# EasyEDA Pro project ACS Core.eprj, board Card Slot Reader
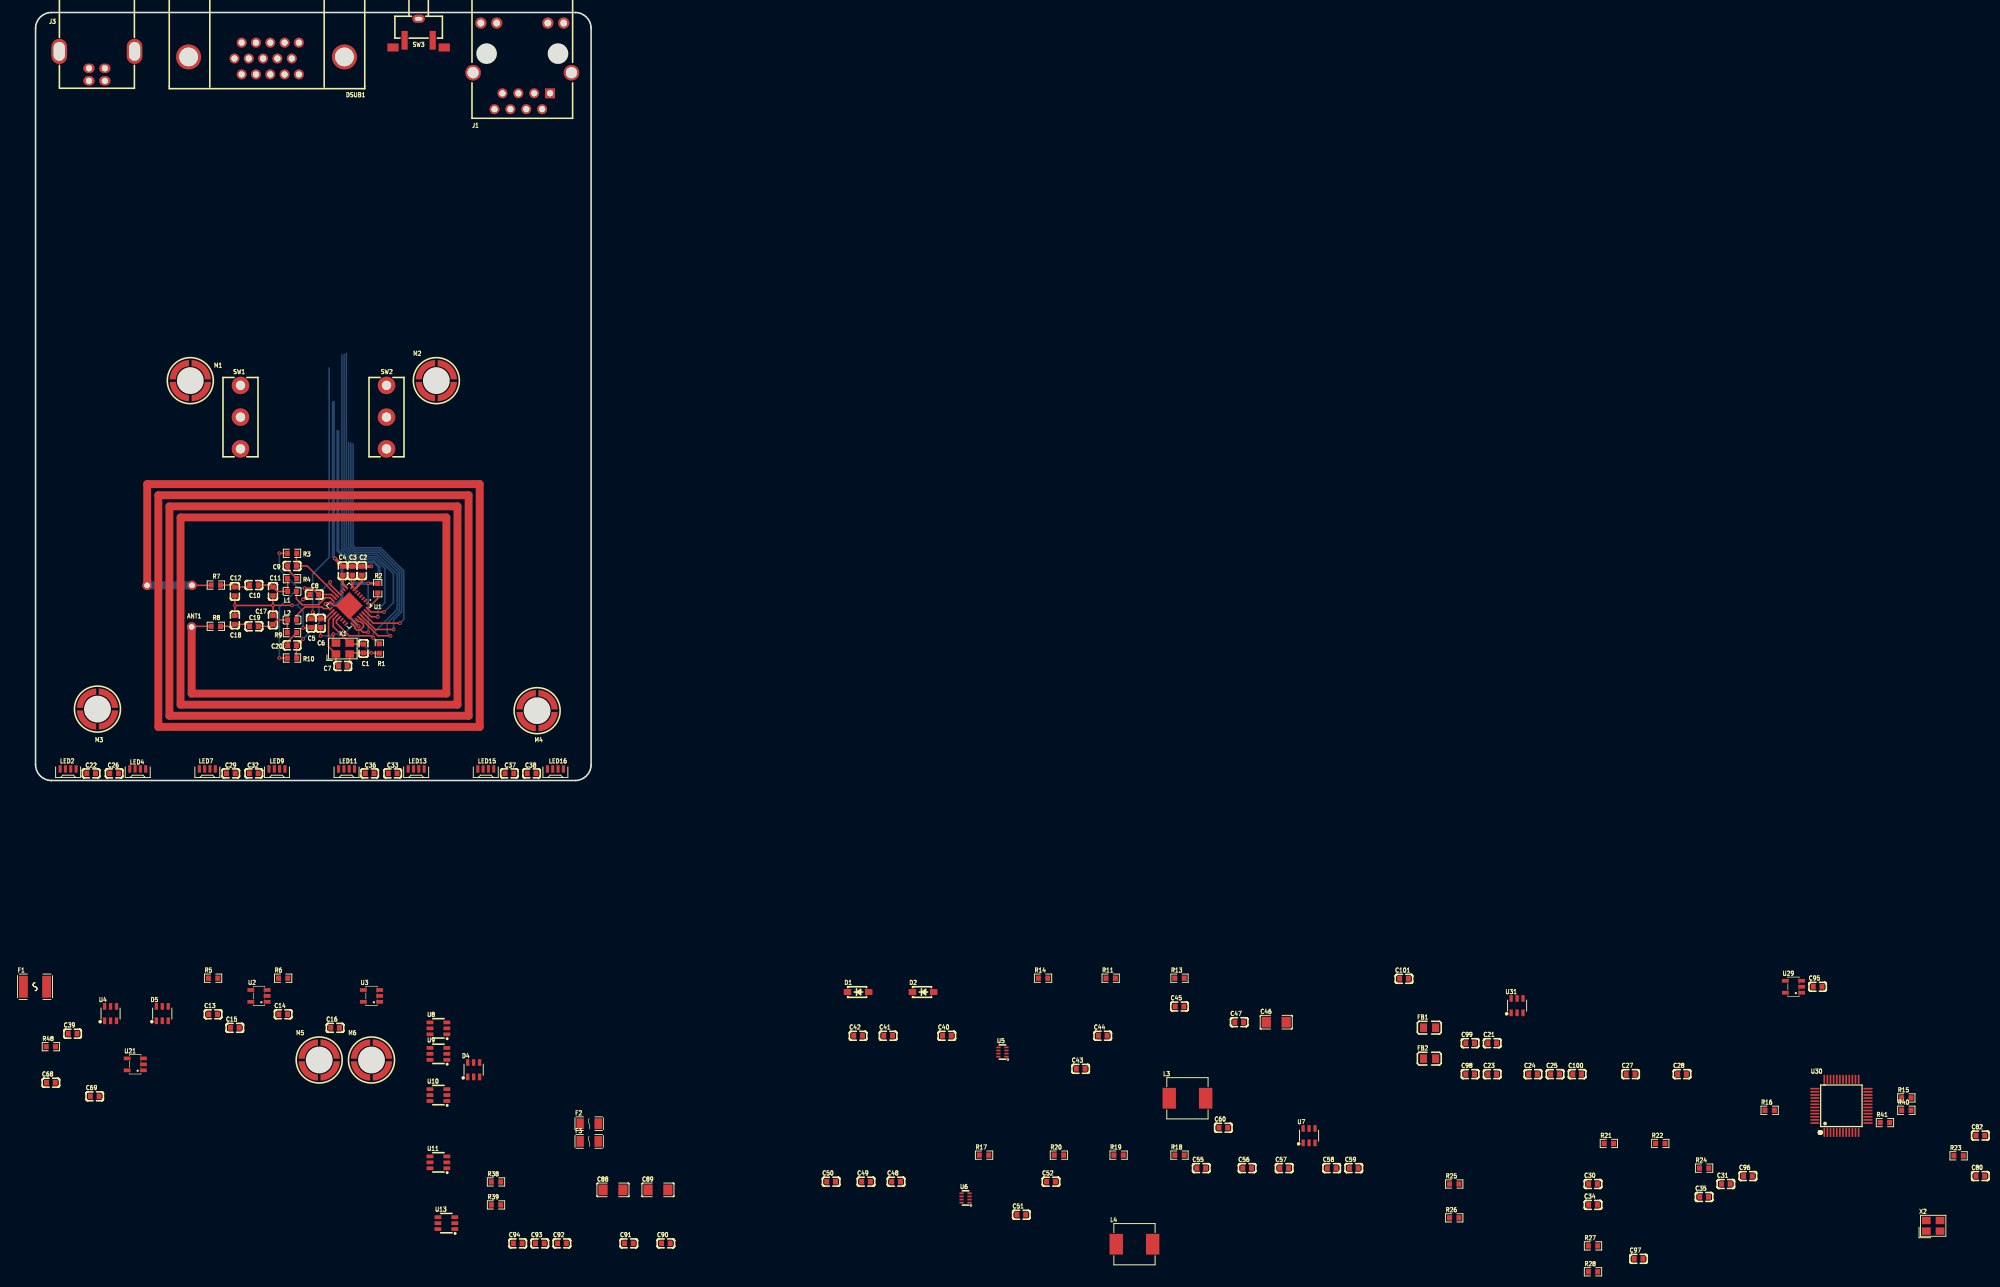
[diagram p7: board, top side]
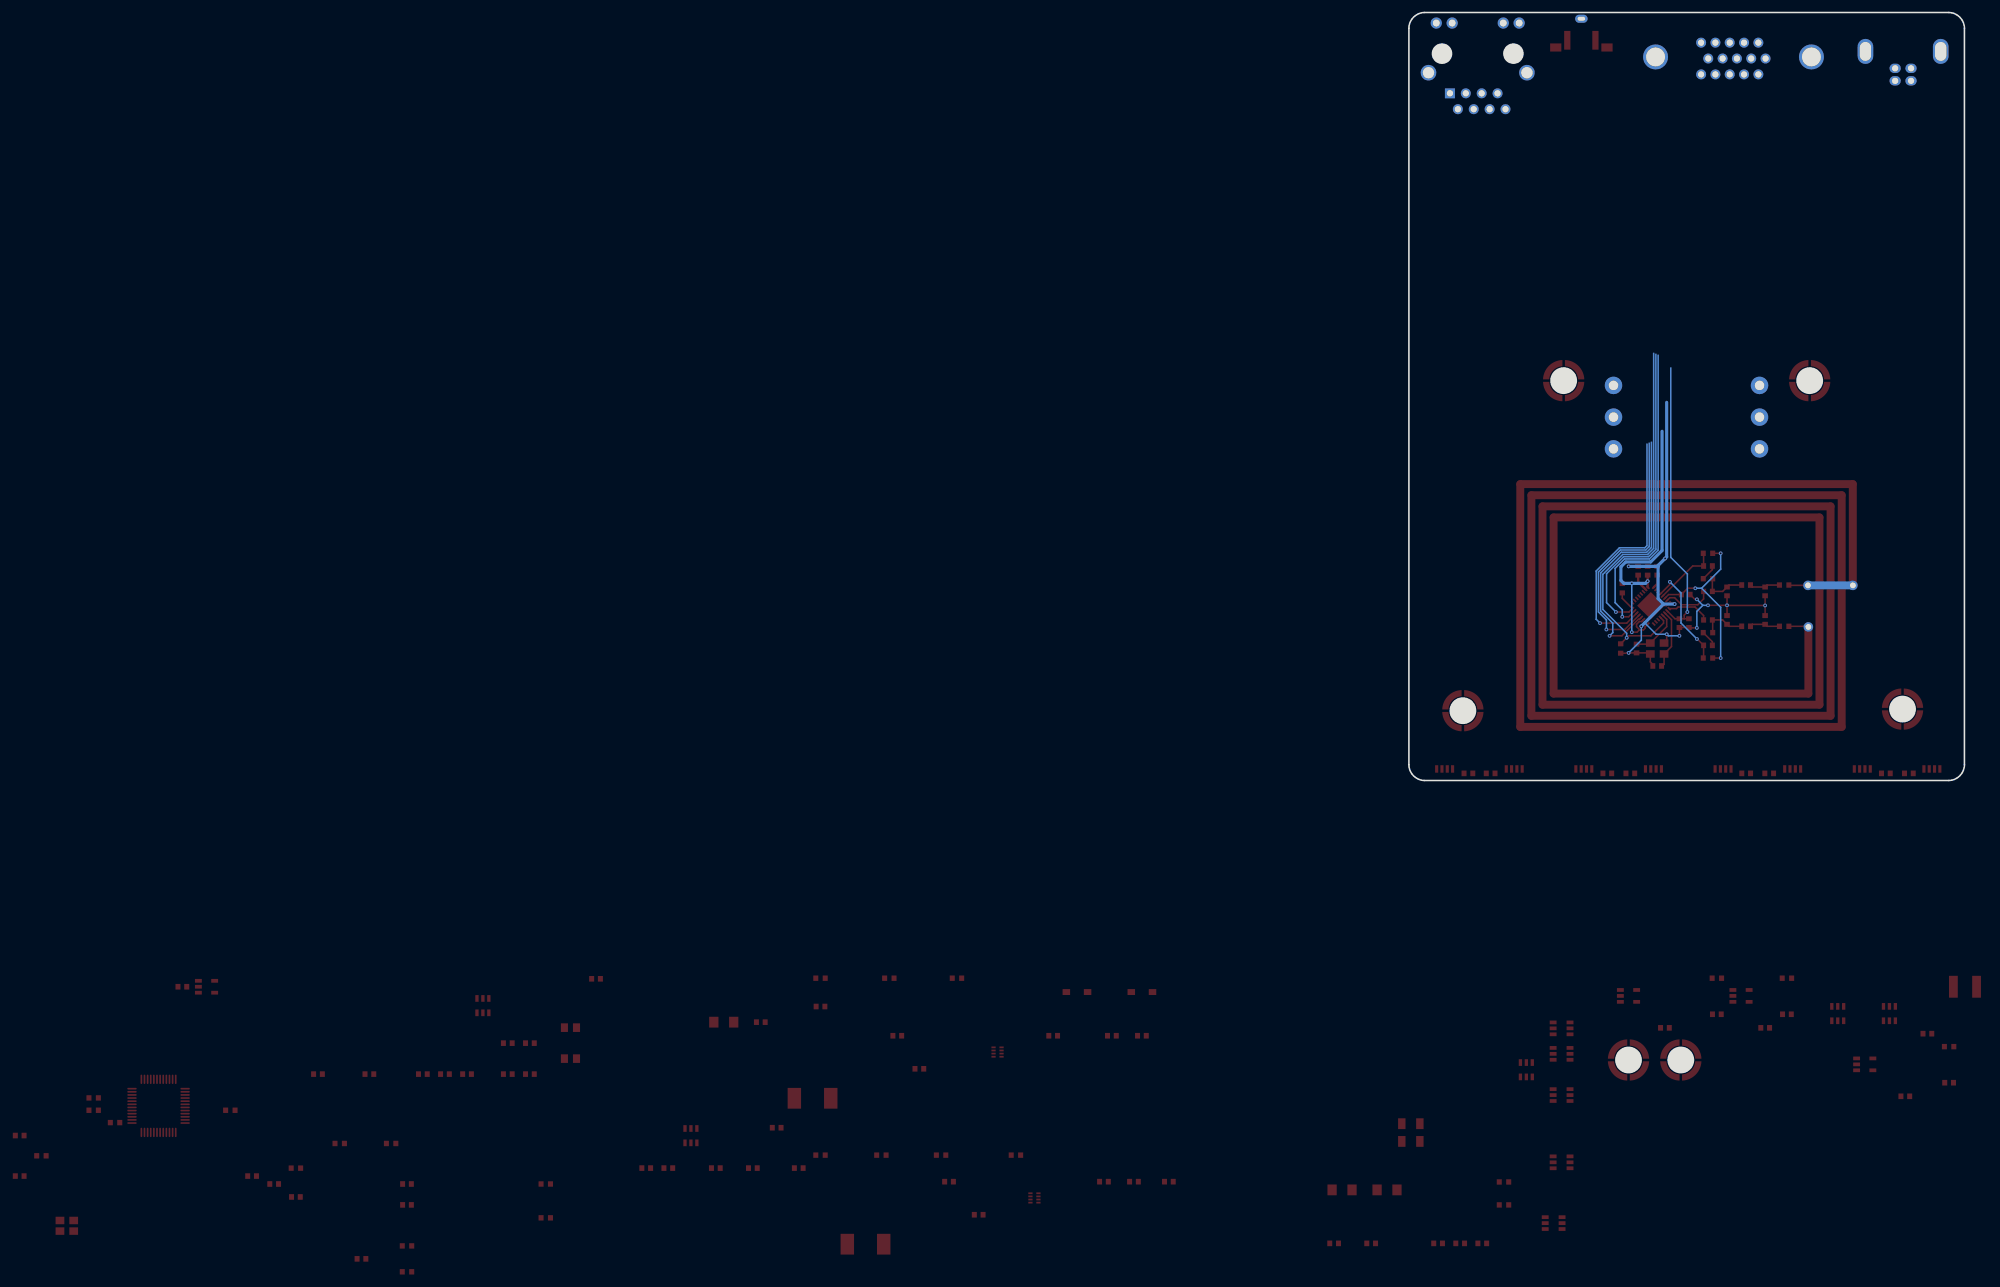
[diagram p8: board, bottom side, seen from below]

Outline 88.9 x 169.82 mm; copper layers: Top Layer, Inner1, Inner2, Bottom Layer. Coordinates in mm from the lower left corner of the outline.
Outline path: 0,167.28 0,49.43 arc(0.74,47.63) 2.54,46.89 86.36,46.89 arc(88.16,47.63) 88.9,49.43 88.9,167.28 arc(88.16,169.08) 86.36,169.82 2.54,169.82 arc(0.74,169.08) 0,167.28
Stack: Top Layer 0.035mm / Dielectric1 1.51mm FR4 er 4.5 / Inner1 0.035mm / Dielectric2 0.48mm PP er 4.5 / Inner2 0.035mm / Dielectric3 0.48mm PP er 4.5 / Bottom Layer 0.035mm

## Design rules (mm)
template: JLCPCB Capability(Two Layers Board)
spacing copperThickness1oz (default): track to track 0.102, other pairs 0.152 to 0.3
spacing copperThickness2oz: track to track 0.203, other pairs 0.152 to 0.3
track width copperThickness1oz (default): min 0.127, default 0.254, max 2.54
track width copperThickness2oz: min 0.203, default 0.254, max 2.54
differential pair differentialPair (default): width min 0.127, default 0.254, max 2.54; gap min 0.152, default 0.152
via viaSize (default): diameter min 0.5, default 0.61, max 10; hole min 0.3, default 0.305, max 6.3

## Placement (name value [footprint] x y rotation side)
ANT1  -  [NFC Antenna Footprint]  43.58 74.62 270 top
C1  12pF  [C0603]  52.47 68.01 90 top
C2  470nF  [C0603]  52.22 80.46 90 top
C3  100nF  [C0603]  50.69 80.46 270 top
C4  470nF  [C0603]  49.17 80.46 270 top
C5  1uF  [C0603]  44.09 72.08 90 top
C6  100nF  [C0603]  45.61 72.08 90 top
C7  12pF  [C0603]  49.17 65.22 180 top
C8  100nF  [C0603]  44.6 76.65 0 top
C9  1nF  [C0603]  41.04 81.22 180 top
C10  68pF  [C0603]  34.94 78.17 180 top
C11  120pF  [C0603]  37.99 77.16 90 top
C12  120pF  [C0603]  31.89 77.16 90 top
C13  100nF  [C0603]  28.41 9.47 0 top
C14  100nF  [C0603]  39.62 9.47 0 top
C15  100nF  [C0603]  31.89 7.29 0 top
C16  100nF  [C0603]  47.93 7.29 0 top
C17  120pF  [C0603]  37.99 72.59 90 top
C18  120pF  [C0603]  31.89 72.59 90 top
C19  68pF  [C0603]  34.94 71.57 180 top
C20  1nF  [C0603]  41.04 68.52 180 top
C21  100nF  [C0603]  233.1 4.84 0 top
C22  100nF  [C0603]  8.89 48.03 180 top
C23  100nF  [C0603]  233.1 -0.12 0 top
C24  100nF  [C0603]  239.62 -0.12 0 top
C25  100nF  [C0603]  243.16 -0.12 0 top
C26  100nF  [C0603]  12.57 48.03 0 top
C27  100nF  [C0603]  255.25 -0.12 0 top
C28  100nF  [C0603]  263.48 -0.12 0 top
C29  100nF  [C0603]  31.24 48.03 180 top
C30  6.8nF  [C0603]  249.23 -17.7 0 top
C31  4.7uF  [C0603]  270.49 -17.7 0 top
C32  100nF  [C0603]  34.92 48.03 0 top
C33  100nF  [C0603]  57.15 48.03 0 top
C34  6.8nF  [C0603]  249.23 -21.05 0 top
C35  10nF  [C0603]  267.01 -19.78 0 top
C36  100nF  [C0603]  53.47 48.03 180 top
C37  100nF  [C0603]  75.82 48.03 180 top
C38  100nF  [C0603]  79.38 48.03 0 top
C39  1uF  [C0603]  5.93 6.36 0 top
C40  100nF  [C0603]  145.83 6.03 0 top
C41  10uF  [C0603]  136.43 6.03 0 top
C42  10uF  [C0603]  131.63 6.03 0 top
C43  100nF  [C0603]  167.24 0.73 0 top
C44  33nF  [C0603]  170.78 6.03 0 top
C45  30pF  [C0603]  183.06 10.71 0 top
C46  47uF  [C1206]  198.54 8.2 0 top
C47  10uF  [C0603]  192.61 8.2 0 top
C48  100nF  [C0603]  137.7 -17.33 0 top
C49  10uF  [C0603]  132.9 -17.33 0 top
C50  10uF  [C0603]  127.31 -17.33 0 top
C51  100nF  [C0603]  157.75 -22.63 0 top
C52  33nF  [C0603]  162.49 -17.33 0 top
C55  10uF  [C0603]  186.54 -15.16 0 top
C56  10uF  [C0603]  193.88 -15.16 0 top
C57  10uF  [C0603]  199.81 -15.16 0 top
C58  10uF  [C0603]  207.42 -15.16 0 top
C59  10uF  [C0603]  210.95 -15.16 0 top
C60  1uF  [C0603]  190.07 -8.7 0 top
C68  100nF  [C0603]  2.45 -1.49 0 top
C69  100nF  [C0603]  9.46 -3.66 0 top
C80  18pF  [C0603]  311.21 -16.43 0 top
C82  18pF  [C0603]  311.21 -9.95 0 top
C88  47uF  [C1206]  92.4 -18.65 0 top
C89  47uF  [C1206]  99.6 -18.65 0 top
C90  10uF  [C0603]  100.87 -27.21 0 top
C91  10uF  [C0603]  94.94 -27.21 0 top
C92  10uF  [C0603]  84.23 -27.21 0 top
C93  10uF  [C0603]  80.69 -27.21 0 top
C94  10uF  [C0603]  77.16 -27.21 0 top
C95  100nF  [C0603]  285.18 13.87 0 top
C96  10nF  [C0603]  274.02 -16.43 0 top
C97  10nF  [C0603]  256.52 -29.69 0 top
C98  10uF  [C0603]  229.57 -0.12 0 top
C99  10uF  [C0603]  229.57 4.84 0 top
C100  100nF  [C0603]  246.69 -0.12 0 top
C101  1uF  [C0603]  218.98 15.14 0 top
D1  B5819W SL  [SOD-123_L2.7-W1.6-LS3.7-RD-1]  131.63 13.02 0 top
D2  B5819W SL  [SOD-123_L2.7-W1.6-LS3.7-RD-1]  142.02 13.02 0 top
D4  SRV05-4  [SOT-23-6_L2.9-W1.6-P0.95-LS2.8-BL]  70.11 0.59 0 top
D5  SRV05-4  [SOT-23-6_L2.9-W1.6-P0.95-LS2.8-BL]  20.27 9.58 0 top
DSUB1  DS1038-15FBNSiA74-0CC  [DSUB-TH_DS1038-15FBNSIA74-0CC]  36.96 162.46 180 top
F1  SMD1206B050TF  [F1812]  -0.09 13.87 0 top
F2  JK-nSMD100-16  [F1206]  88.59 -8.05 0 top
F3  JK-nSMD100-16  [F1206]  88.59 -10.89 0 top
FB1  MH2029-300Y  [L0805]  223.07 7.33 0 top
FB2  MH2029-300Y  [L0805]  223.07 2.36 0 top
J1  HC913129AE-907-A  [RJ45-TH_HC911102A-904-A]  77.89 161.24 180 top
J3  U-USBBR04P-F001  [USB-B-TH_U241-041N-1BR85-1]  9.82 161.24 180 top
L1  470nH  [L0603]  41.04 77.16 180 top
L2  470nH  [L0603]  41.04 72.59 180 top
L3  4.7uH  [IND-SMD_L7.1-W6.6]  184.33 -3.98 0 top
L4  4.7uH  [IND-SMD_L7.1-W6.6]  175.86 -27.34 0 top
LED2  WS2812C-4020  [LED-SMD_4P-L4.0-W1.7-R]  5.21 48.74 180 top
LED4  WS2812C-4020  [LED-SMD_4P-L4.0-W1.7-R]  16.35 48.74 180 top
LED7  WS2812C-4020  [LED-SMD_4P-L4.0-W1.7-R]  27.49 48.74 180 top
LED9  WS2812C-4020  [LED-SMD_4P-L4.0-W1.7-R]  38.63 48.74 180 top
LED11  WS2812C-4020  [LED-SMD_4P-L4.0-W1.7-R]  49.77 48.74 180 top
LED13  WS2812C-4020  [LED-SMD_4P-L4.0-W1.7-R]  60.91 48.74 180 top
LED15  WS2812C-4020  [LED-SMD_4P-L4.0-W1.7-R]  72.05 48.74 180 top
LED16  WS2812C-4020  [LED-SMD_4P-L4.0-W1.7-R]  83.19 48.74 180 top
M1  SMTSO30100CTJ  [SCREW-SMD_BD5.6-D4.1-H10]  24.77 110.89 0 top
M2  SMTSO30100CTJ  [SCREW-SMD_BD5.6-D4.1-H10]  64.14 110.89 0 top
M3  SMTSO30100CTJ  [SCREW-SMD_BD5.6-D4.1-H10]  9.91 58.32 0 top
M4  SMTSO30100CTJ  [SCREW-SMD_BD5.6-D4.1-H10]  80.26 58.06 0 top
M5  SMTSO30100CTJ  [SCREW-SMD_BD5.6-D4.1-H10]  45.39 2.15 0 top
M6  SMTSO30100CTJ  [SCREW-SMD_BD5.6-D4.1-H10]  53.76 2.15 0 top
R1  10kΩ  [R0603]  55.01 68.01 90 top
R2  10kΩ  [R0603]  54.76 77.67 90 top
R3  1kΩ  [R0603]  41.04 83.25 180 top
R4  22kΩ  [R0603]  41.04 79.19 180 top
R5  100kΩ  [R0603]  28.41 15.24 0 top
R6  100kΩ  [R0603]  39.62 15.24 0 top
R7  5.1Ω  [R0603]  28.85 78.17 180 top
R8  5.1Ω  [R0603]  28.85 71.57 180 top
R9  22kΩ  [R0603]  41.04 70.55 180 top
R10  1kΩ  [R0603]  41.04 66.49 180 top
R11  10kΩ  [R0603]  172.05 15.24 0 top
R13  22kΩ  [R0603]  183.06 15.24 0 top
R14  10kΩ  [R0603]  161.22 15.24 0 top
R15  10kΩ  [R0603]  299.37 -3.93 0 top
R16  12.4kΩ  [R0603]  277.5 -5.9 0 top
R17  10kΩ  [R0603]  151.79 -13.08 0 top
R18  51kΩ  [R0603]  183.06 -13.08 0 top
R19  1kΩ  [R0603]  173.32 -13.08 0 top
R20  1kΩ  [R0603]  163.76 -13.08 0 top
R21  49.9Ω  [R0603]  251.77 -11.22 0 top
R22  49.9Ω  [R0603]  260 -11.22 0 top
R23  1MΩ  [R0603]  307.74 -13.19 0 top
R24  10Ω  [R0603]  267.01 -15.16 0 top
R25  1kΩ  [R0603]  227.03 -17.7 0 top
R26  1kΩ  [R0603]  227.03 -23.12 0 top
R27  49.9Ω  [R0603]  249.23 -27.61 0 top
R28  49.9Ω  [R0603]  249.23 -31.76 0 top
R38  4.7kΩ  [R0603]  73.68 -17.38 0 top
R39  4.7kΩ  [R0603]  73.68 -21.05 0 top
R40  10kΩ  [R0603]  299.37 -5.9 0 top
R41  10kΩ  [R0603]  295.95 -7.87 0 top
R48  100kΩ  [R0603]  2.45 4.28 0 top
SW1  K9-1267F  [SW-TH_K9-1267F]  32.79 105.05 90 top
SW2  K9-1267F  [SW-TH_K9-1267F]  56.16 105.05 90 top
SW3  TS-1045-A13B3-D2  [SW-SMD_L7.5-W8.0-P4.50_TS-1045-A13B3-D2]  61.3 166.52 180 top
U1  MFRC63003HNE  [HVQFN-32_L5.0-W5.0-P0.50-TL-EP3.1]  50.18 74.87 225 top
U2  SN74LVC1G17DBVR  [SOT-23-5_L3.0-W1.7-P0.95-LS2.8-BR]  35.75 12.4 0 top
U3  SN74LVC1G17DBVR  [SOT-23-5_L3.0-W1.7-P0.95-LS2.8-BR]  53.76 12.4 0 top
U4  MX66100T  [SOT-23-6_L2.9-W1.6-P0.95-LS2.9-BL]  12 9.58 0 top
U5  TPS62933DRLR  [SOT-583-8_L2.1-W1.2-P0.50-LS1.6-BR]  154.73 3.42 0 top
U6  TPS62933DRLR  [SOT-583-8_L2.1-W1.2-P0.50-LS1.6-BR]  148.83 -19.94 0 top
U7  MX66100T  [SOT-23-6_L2.9-W1.6-P0.95-LS2.9-BL]  203.8 -9.97 0 top
U8  SN74LVC1T45DBVR  [SOT-23-6_L2.9-W1.6-P0.95-LS2.8-BR]  64.47 7.21 0 top
U9  SN74LVC1T45DBVR  [SOT-23-6_L2.9-W1.6-P0.95-LS2.8-BR]  64.47 3.13 0 top
U10  SN74LVC1T45DBVR  [SOT-23-6_L2.9-W1.6-P0.95-LS2.8-BR]  64.47 -3.47 0 top
U11  SN74LVC1T45DBVR  [SOT-23-6_L2.9-W1.6-P0.95-LS2.8-BR]  64.47 -14.23 0 top
U13  SN74LVC1T45DBVR  [SOT-23-6_L2.9-W1.6-P0.95-LS2.8-BR]  65.74 -23.96 0 top
U21  SN74LVC1G17DBVR  [SOT-23-5_L3.0-W1.7-P0.95-LS2.8-BR]  15.96 1.45 0 top
U29  SN74AHC1G125DBVR  [SOT-23-5_L3.0-W1.7-P0.95-LS2.8-BR]  281.31 13.87 0 top
U30  W5500  [LQFP-48_L7.0-W7.0-P0.50-LS9.0-BL]  288.99 -5.2 0 top
U31  MX66100T  [SOT-23-6_L2.9-W1.6-P0.95-LS2.9-BL]  237.08 10.85 0 top
X1  27.12MHz  [CRYSTAL-SMD_4P-L3.2-W2.5-BL-1]  49.17 68.01 0 top
X2  25MHz  [CRYSTAL-SMD_4P-L3.2-W2.5-BL]  303.67 -24.39 0 top

## Footprints (pads in the part's own frame, mm; a bottom-side part is the same pattern mirrored in y, then rotated)
C0603
  rect 0.8x0.9 smd: 1(-0.7,0) 2(0.7,0)
C1206
  rect 1.485x1.728 smd: 1(-1.593,0) 2(1.593,0)
CRYSTAL-SMD_4P-L3.2-W2.5-BL
  rect 1.4x1.2 smd: 1(-1.1,-0.85) 2(1.1,-0.85) 3(1.1,0.85) 4(-1.1,0.85)
CRYSTAL-SMD_4P-L3.2-W2.5-BL-1
  rect 1.4x1.2 smd: 1(-1.1,-0.875) 2(1.1,-0.875) 3(1.1,0.875) 4(-1.1,0.875)
DSUB-TH_DS1038-15FBNSIA74-0CC
  round 1.6 hole 1: 1(3.978,2.54) 2(1.688,2.54) 3(-0.603,2.54) 4(-2.893,2.54) 5(-5.182,2.54) 6(5.128,0) 7(2.837,0) 8(0.548,0) 9(-1.743,0) 10(-4.042,0) 11(3.978,-2.54) 12(1.688,-2.54) 13(-0.603,-2.54) 14(-2.893,-2.54) 15(-5.182,-2.54)
  round 4 hole 3: 16(12.473,-0.254) 17(-12.473,-0.254)
F1206
  rect 1.19x1.728 smd: 1(-1.445,0) 2(1.445,0)
F1812
  rect 1.407x3.499 smd: 1(-1.853,0) 2(1.853,0)
HVQFN-32_L5.0-W5.0-P0.50-TL-EP3.1
  rect 0.665x0.28 smd: 1(-2.408,1.75) 2(-2.408,1.25) 3(-2.408,0.75) 4(-2.408,0.25) 5(-2.408,-0.25) 6(-2.408,-0.75) 7(-2.408,-1.25) 8(-2.408,-1.75) 17(2.408,-1.75) 18(2.408,-1.25) 19(2.408,-0.75) 20(2.408,-0.25) 21(2.408,0.25) 22(2.408,0.75) 23(2.408,1.25) 24(2.408,1.75)
  rect 0.28x0.665 smd: 9(-1.75,-2.408) 10(-1.25,-2.408) 11(-0.75,-2.408) 12(-0.25,-2.408) 13(0.25,-2.408) 14(0.75,-2.408) 15(1.25,-2.408) 16(1.75,-2.408) 25(1.75,2.408) 26(1.25,2.408) 27(0.75,2.408) 28(0.25,2.408) 29(-0.25,2.408) 30(-0.75,2.408) 31(-1.25,2.408) 32(-1.75,2.408)
  rect 3.1x3.1 smd: 33(0,0)
IND-SMD_L7.1-W6.6
  rect 2.15x3.32 smd: 1(-2.913,0) 2(2.913,0)
L0603
  rect 0.8x0.864 smd: 1(-0.7,0) 2(0.7,0)
L0805
  rect 1.133x1.377 smd: 1(-0.966,0) 2(0.966,0)
LED-SMD_4P-L4.0-W1.7-R
  rect 0.5x1.2 smd: 1(1.275,0) 2(0.425,0) 3(-0.425,0) 4(-1.275,0)
LQFP-48_L7.0-W7.0-P0.50-LS9.0-BL
  oval 0.27x1.5 smd: 1(-2.75,-4.25) 2(-2.25,-4.25) 3(-1.75,-4.25) 4(-1.25,-4.25) 5(-0.75,-4.25) 6(-0.25,-4.25) 7(0.25,-4.25) 8(0.75,-4.25) 9(1.25,-4.25) 10(1.75,-4.25) 11(2.25,-4.25) 12(2.75,-4.25) 25(2.75,4.25) 26(2.25,4.25) 27(1.75,4.25) 28(1.25,4.25) 29(0.75,4.25) 30(0.25,4.25) 31(-0.25,4.25) 32(-0.75,4.25) 33(-1.25,4.25) 34(-1.75,4.25) 35(-2.25,4.25) 36(-2.75,4.25)
  oval 1.5x0.27 smd: 13(4.25,-2.75) 14(4.25,-2.25) 15(4.25,-1.75) 16(4.25,-1.25) 17(4.25,-0.75) 18(4.25,-0.25) 19(4.25,0.25) 20(4.25,0.75) 21(4.25,1.25) 22(4.25,1.75) 23(4.25,2.25) 24(4.25,2.75) 37(-4.25,2.75) 38(-4.25,2.25) 39(-4.25,1.75) 40(-4.25,1.25) 41(-4.25,0.75) 42(-4.25,0.25) 43(-4.25,-0.25) 44(-4.25,-0.75) 45(-4.25,-1.25) 46(-4.25,-1.75) 47(-4.25,-2.25) 48(-4.25,-2.75)
NFC Antenna Footprint
  round 1.524 hole 0.914: 1(-3.505,-18.542) 1(-3.505,-25.73) 2(3.15,-18.603)
R0603
  rect 0.806x0.864 smd: 1(-0.753,0) 2(0.753,0)
RJ45-TH_HC911102A-904-A
  rect 1.6x1.6 hole 1: 1(-4.445,4.355)
  round 1.6 hole 1: 2(-3.175,6.895) 3(-1.905,4.355) 4(-0.635,6.895) 5(0.635,4.355) 6(1.905,6.895) 7(3.175,4.355) 8(4.445,6.895)
  round 1.8 hole 1.1: 9(-6.63,-6.895) 10(-4.09,-6.895) 11(4.09,-6.895) 12(6.63,-6.895)
  round 2.5 hole 1.8: 13(-7.875,1.055) 13(7.875,1.055)
SCREW-SMD_BD5.6-D4.1-H10
  custom 3.1x3.1 smd: 1(-2.202,1.75) 2(1.75,2.202) 3(2.202,-1.75) 4(-1.75,-2.202)
SOD-123_L2.7-W1.6-LS3.7-RD-1
  rect 1.2x0.95 smd: 1(-1.7,0) 2(1.7,0)
SOT-23-5_L3.0-W1.7-P0.95-LS2.8-BR
  rect 1.1x0.6 smd: 1(1.3,-0.95) 2(1.3,0) 3(1.3,0.95) 4(-1.3,0.95) 5(-1.3,-0.95)
SOT-23-6_L2.9-W1.6-P0.95-LS2.8-BL
  rect 0.532x1.072 smd: 1(-0.95,-1.149) 2(0,-1.149) 3(0.95,-1.149) 4(0.95,1.149) 5(0,1.149) 6(-0.95,1.149)
SOT-23-6_L2.9-W1.6-P0.95-LS2.8-BR
  rect 1.1x0.6 smd: 1(1.35,-0.95) 2(1.35,0) 3(1.35,0.95) 4(-1.35,0.95) 5(-1.35,0) 6(-1.35,-0.95)
SOT-23-6_L2.9-W1.6-P0.95-LS2.9-BL
  rect 0.532x1.072 smd: 1(-0.95,-1.149) 2(0,-1.149) 3(0.95,-1.149) 4(0.95,1.149) 5(0,1.149) 6(-0.95,1.149)
SOT-583-8_L2.1-W1.2-P0.50-LS1.6-BR
  rect 0.68x0.28 smd: 1(0.64,-0.75) 2(0.64,-0.25) 3(0.64,0.25) 4(0.64,0.75) 5(-0.64,0.75) 6(-0.64,0.25) 7(-0.64,-0.25) 8(-0.64,-0.75)
SW-SMD_L7.5-W8.0-P4.50_TS-1045-A13B3-D2
  rect 1x3 smd: 1(-2.25,1.15) 2(2.25,1.15)
  rect 1.8x1.3 smd: 3(-4.1,2.3) 3(4.1,2.3)
  oval 2x1.3 hole 1.2x0.6: 3(0,-2.3)
SW-TH_K9-1267F
  round 2.8 hole 1.5: 1(-5.08,0) 2(0,0) 3(5.08,0)
USB-B-TH_U241-041N-1BR85-1
  oval 1.8x1.5 hole 1: 1(1.27,2.355) 2(-1.27,2.355) 3(-1.27,0.355) 4(1.27,0.355)
  oval 2.5x4 hole 1.8x3: 5(6.025,-2.355) 6(-6.025,-2.355)

## Nets
As in the schematic.

Pads without a net: D4 1 2 3 4 5 6; J1 7; J3 5 6; LED16 3; M1 1 2 3 4; M2 1 2 3 4; M3 1 2 3 4; M4 1 2 3 4; M5 1 2 3 4; M6 1 2 3 4; SW1 3; SW2 3; U1 1 2 3 4 5 6 10 11 22 23 24; U2 1; U3 1; U4 4 5; U5 1 2; U6 1 2; U7 4 5; U8 1 2 3 4 5 6; U9 1 2 3 4 5 6; U10 1 2 3 4 5 6; U11 1 2 3 4 5 6; U13 1 2 3 4 5 6; U21 1; U30 7 12 13 18 24 26 38 39 40 41 42 43 44 45 46 47; U31 4 5

## Via types
v1: diameter 0.61, hole 0.305, Top Layer to Bottom Layer, 27 vias

## Routing (per net, layer and track width the routed paths; a pad name or vN(x,y) marks a point on that pad's centre or on a via; arc(x,y) is an arc through that point)
+5V: length 45.5
  Top Layer w0.254: v1(44.34,73.86) 44.85,73.35 44.85,72.78 ; 44.85,72.78 C6.2 46.32,72.78 U1.18 ; 44.85,72.78 C5.2
  Bottom Layer w0.254: v1(44.34,73.86) 44.34,79.95 46.99,82.6 46.99,112.93
GND: length 106.4
  Top Layer w0.254: C8.1 43.13,75.89 v1(42.82,75.89) ; C18.2 v1(31.89,74.9) ; v1(31.89,74.9) C12.1 ; v1(31.89,74.9) 37.96,74.9 v1(37.99,74.93) ; 49.67,65.28 50.27,65.87 X1.2 50.44,67.31 C1.1 v1(53.74,67.31) 53.79,67.26 R1.1 ; v1(45.61,70.05) C6.1 C5.1 44.02,71.32 v1(42.82,71.32) ; C11.1 v1(37.99,74.93) ; v1(37.99,74.93) v1(41.04,74.93) ; v1(37.99,74.93) C17.2 ; v1(51.71,71.57) 51,72.27 U1.26 50.18,73.1 U1.33 47.71,74.87 47.24,75.34 46.58,75.34 v1(46.37,75.13) ; X1.4 47.64,69.31 v1(47.64,70.3)
  Top Layer w0.508: v1(47.9,82.43) C4.1 C3.1 C2.2 v1(53.74,81.16)
  Bottom Layer w0.254: v1(42.82,75.89) 41.86,74.93 ; 41.86,74.93 v1(41.04,74.93) ; 41.86,74.93 42.82,73.97 v1(42.82,71.32) ; v1(45.61,70.05) 47.39,70.05 v1(47.64,70.3) 49.34,70.3 51.16,72.12 ; v1(53.74,67.31) 51.71,69.35 v1(51.71,71.57)
  Bottom Layer w0.508: 49.02,81.16 49.02,81.3 v1(47.9,82.43) 47.65,82.68 47.65,107.41 ; 49.02,81.16 v1(53.74,81.16) ; 49.02,81.16 49.02,76 48.15,75.13 ; 48.15,75.13 v1(46.37,75.13) ; 48.15,75.13 v1(51.71,71.57)
VCC: length 50.6
  Top Layer w0.254: 51.99,71.03 52.47,71.51 52.47,71.88 52.02,72.33 51.66,72.33 U1.27 ; 51.99,71.03 52.39,70.63 v1(53.23,70.63) ; 51.99,71.03 51.95,70.99 51.38,70.99 51.12,71.24 51.12,71.46 50.65,71.93 ; R2.2 54.74,78.44 v1(53.23,78.44)
  Top Layer w0.381: C3.2 v1(50.69,78.79) 50.69,77.85 50.65,77.81
  Bottom Layer w0.254: v1(53.23,70.63) v1(53.23,78.44)
  Bottom Layer w0.508: v1(50.69,78.79) 51.04,78.44 v1(53.23,78.44) 54.51,78.44 54.97,78.9 54.97,81.09 54.19,81.87 50.21,81.87 48.39,83.7 48.39,102.78
CS_NFC: length 49.9
  Top Layer w0.254: U1.31 53.73,73.09 v1(54.76,73.09)
  Bottom Layer w0.254: v1(54.76,73.09) 54.76,74.21 55.91,75.36 55.91,80.84 54.39,82.35 50.41,82.35 49.02,83.75 49.02,114.96
IRQ: length 53.5
  Top Layer w0.254: v1(55.77,73.86) 53.67,73.86 53.12,74.41 54.76,76.04 R2.1
  Bottom Layer w0.254: 49.38,115.12 49.38,83.89 50.56,82.71 54.54,82.71 57.27,79.98 57.27,75.35 v1(55.77,73.86)
MISO: length 41.2
  Top Layer w0.254: v1(58.31,72.08) 54.04,72.08 U1.30
  Bottom Layer w0.254: 50.8,100.73 50.8,84.48 51.15,84.13 55.21,84.13 58.93,80.41 58.93,72.69 v1(58.31,72.08)
MOSI: length 44
  Top Layer w0.254: v1(56.79,70.05) 54.81,70.05 52.17,72.69 52.01,72.69 51.71,72.99
  Bottom Layer w0.254: 50.09,101.03 50.09,84.19 50.86,83.42 54.91,83.42 58.22,80.12 58.22,74.01 56.28,72.08 56.28,70.55 v1(56.79,70.05)
NFCRXN: length 10.6
  Top Layer w0.254: R3.1 41.74,83.2 C9.1 43.48,81.22 48.3,76.4
NFCRXP: length 17
  Top Layer w0.254: v1(47.14,78.68) 47.14,78.27 48.66,76.75 ; R10.1 41.74,66.54 C20.1 42.76,69.54 v1(42.81,69.54)
  Bottom Layer w0.254: v1(42.81,69.54) 45.36,72.09 45.36,76.9 v1(47.14,78.68)
PDOWN: length 62.2
  Top Layer w0.254: 48.66,72.99 48.15,72.49 48.15,72.08 50.18,70.05 53.73,70.05 v1(54.05,69.73) R1.2
  Bottom Layer w0.254: 49.73,115.26 49.73,84.04 50.71,83.06 54.69,83.06 57.86,79.89 57.86,74.27 54.05,70.45 v1(54.05,69.73)
SCK: length 42.3
  Top Layer w0.254: 52.06,73.35 54.35,71.06 v1(57.3,71.06)
  Bottom Layer w0.254: 50.45,100.88 50.45,84.33 51,83.78 55.06,83.78 58.57,80.27 58.57,73.87 57.3,72.59 v1(57.3,71.06)
TX1: length 6.9
  Top Layer w0.254: L2.1 41.74,73.29 43.11,74.66 45.82,74.66 46.08,74.41 47.24,74.41
TX2: length 8.1
  Top Layer w0.254: U1.15 47.15,76.14 46.37,76.14 45.25,75.02 42.67,75.02 41.74,75.95 L1.1
VMID: length 28.4
  Top Layer w0.254: U1.14 47.34,76.65 C8.2 44.28,77.67 v1(43.07,77.67) ; v1(39.01,83.25) R3.2 ; R10.2 v1(39.01,66.49)
  Bottom Layer w0.254: 42.05,77.67 39.01,80.71 v1(39.01,83.25) ; 42.05,77.67 39.01,74.62 v1(39.01,66.49) ; 42.05,77.67 v1(43.07,77.67)
$2N2483: length 2.2
  Top Layer w0.381: C4.2 49.17,78.36 U1.9
$2N2484: length 2.8
  Top Layer w0.381: U1.7 52.22,78.67 C2.1
$2N2490: length 9.4
  Top Layer w0.254: U1.19 46.88,72.63 46.88,68.32 X1.1 48.07,65.49 48.27,65.28
$2N2492: length 8.1
  Top Layer w0.254: 48.3,73.35 47.64,72.68 47.64,71.51 X1.3 50.44,68.71 C1.2
$2N2516: length 7.2
  Top Layer w0.254: R4.2 40.34,79.14 L1.2 38.69,77.16 C11.2 37.67,78.17 C10.1
$2N2517: length 7.2
  Top Layer w0.254: C19.1 37.67,71.57 C17.1 38.69,72.59 L2.2 40.29,72.53 R9.2
$2N2518: length 4.9
  Top Layer w0.254: R8.1 31.58,71.57 C18.1 33.93,71.89 C19.2
$2N2519: length 4.9
  Top Layer w0.254: R7.1 31.58,78.17 C12.2 33.93,77.86 C10.2
$2N2522: length 2.8
  Top Layer w0.254: R8.2 25.29,71.57
$2N2523: length 3.1
  Top Layer w0.254: R7.2 28.04,78.12 ANT1.1
$2N2526: length 2.6
  Top Layer w0.254: R9.1 40.34,69.1 C20.2
$2N2527: length 2.6
  Top Layer w0.254: C9.2 40.34,80.64 R4.1
